# EAGLE design predkosciomierz (EAGLE 7.7.0)

## Sheet 1 of 2
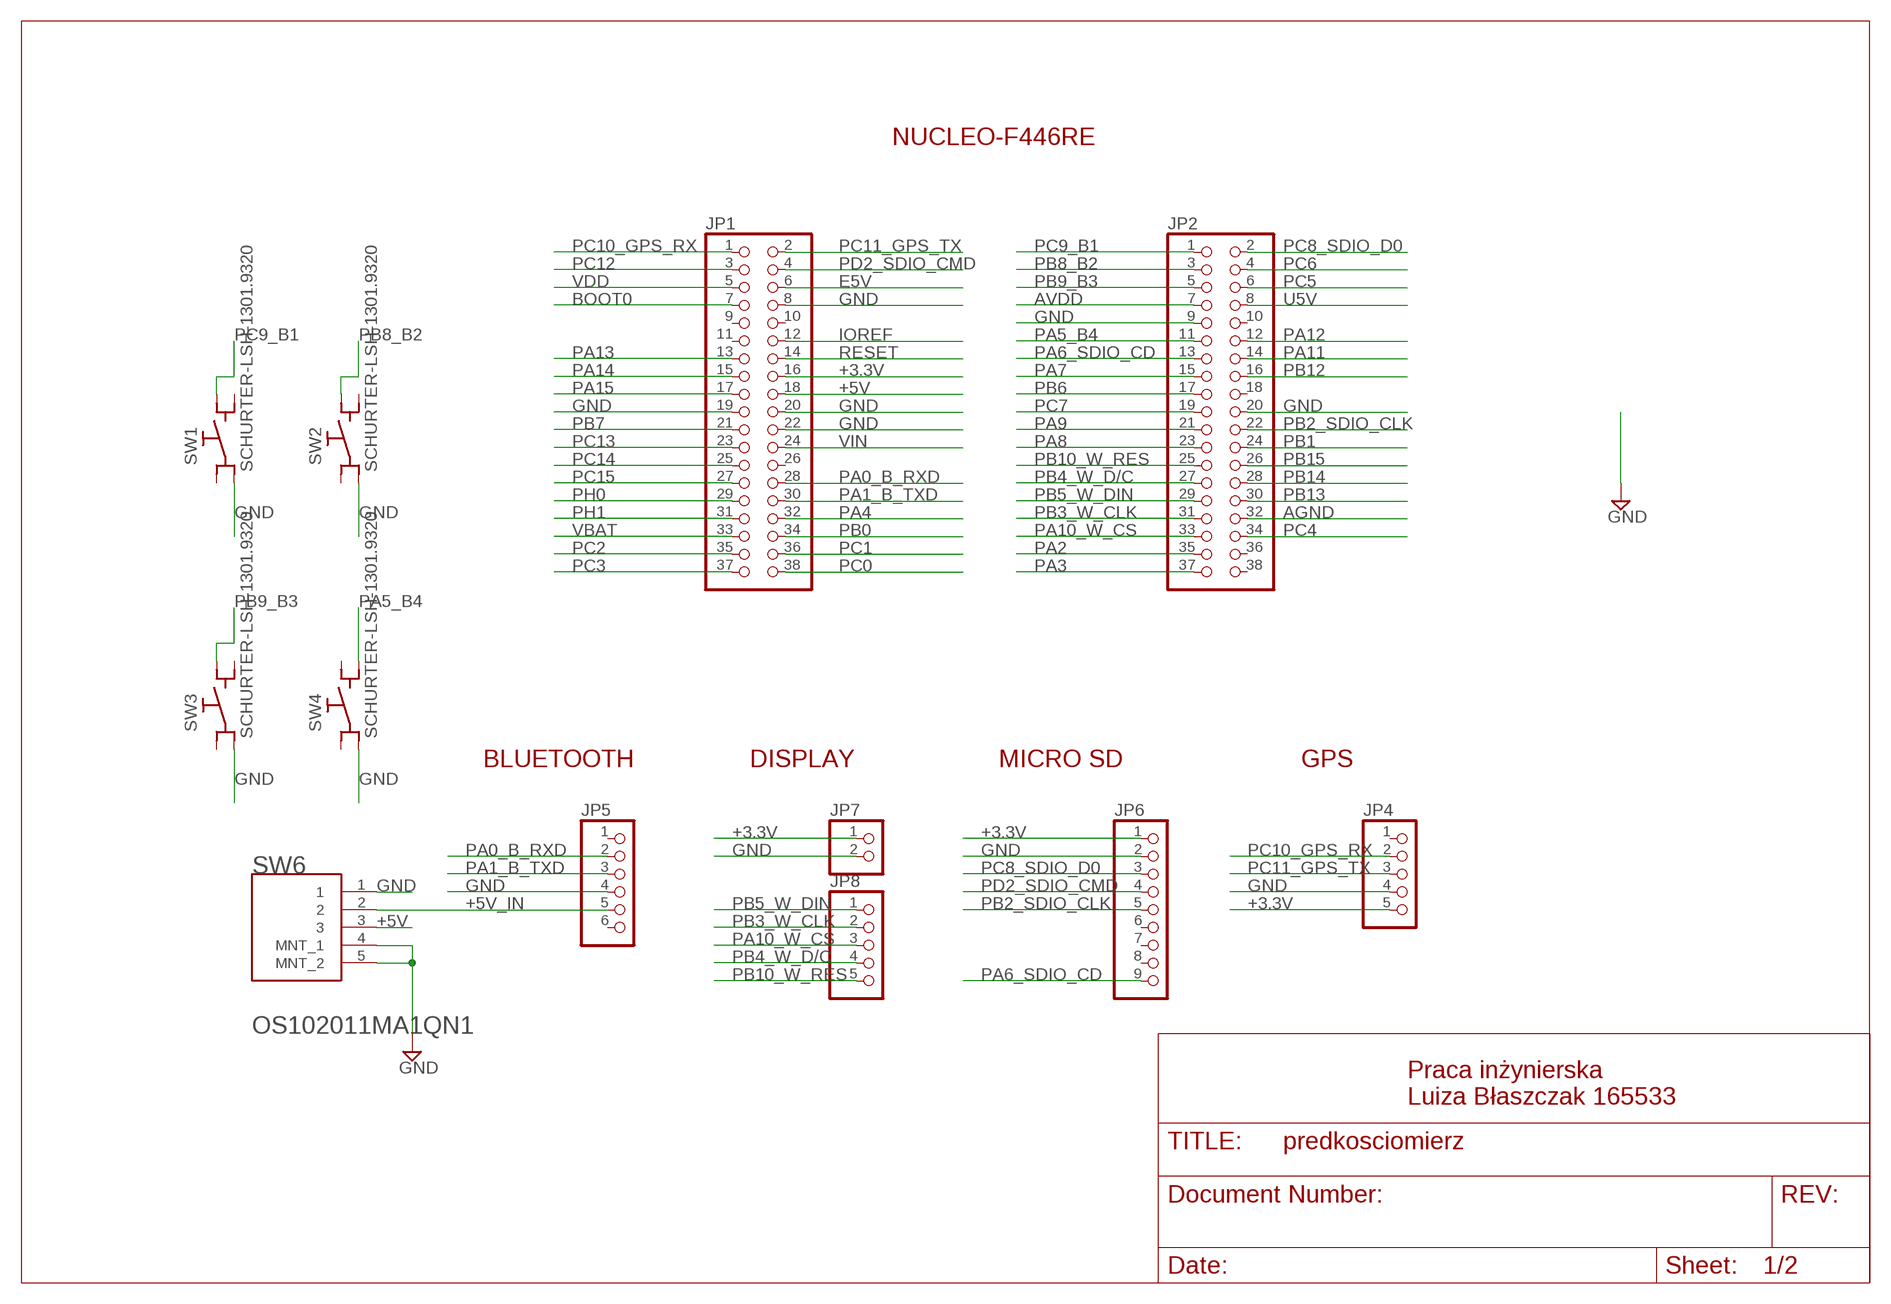
[diagram p0: schematic, sheet 1]

### Parts
JP1  PINHD-2X19  [2X19]
JP2  PINHD-2X19  [2X19]
JP4  PINHD-1X5  [1X05]
JP5  PINHD-1X6  [1X06]
JP6  PINHD-1X9  [1X09]
JP7  PINHD-1X2  [1X02]
JP8  PINHD-1X5  [1X05]
SW1  SCHURTER-LSH-1301.9320  [LSH]
SW2  SCHURTER-LSH-1301.9320  [LSH]
SW3  SCHURTER-LSH-1301.9320  [LSH]
SW4  SCHURTER-LSH-1301.9320  [LSH]
SW6  C&K_OS102011MA1QN1C&K_OS102011MA1QN1_0_0  [C&K_OS102011MA1QN1_0]

### Nets
+3.3V: JP1.16 JP4.5 JP6.1 JP7.1
+5V: JP1.18 SW6.3
+5V_IN: JP5.5 SW6.2
AGND: JP2.32
AVDD: JP2.7
BOOT0: JP1.7
E5V: JP1.6 ; also sheet 2
GND: JP1.8 JP1.19 JP1.20 JP1.22 JP2.9 JP2.20 JP4.4 JP5.4 JP6.2 JP7.2 SW1.C2(C) SW2.C2(C) SW3.C2(C) SW4.C2(C) SW6.1 SW6.4(MNT_1) SW6.5(MNT_2) ; also sheet 2
IOREF: JP1.12
PA0_B_RXD: JP1.28 JP5.2
PA1_B_TXD: JP1.30 JP5.3
PA2: JP2.35
PA3: JP2.37
PA4: JP1.32
PA5_B4: JP2.11 SW4.NO2(NO)
PA6_SDIO_CD: JP2.13 JP6.9
PA7: JP2.15
PA8: JP2.23
PA9: JP2.21
PA10_W_CS: JP2.33 JP8.3
PA11: JP2.14
PA12: JP2.12
PA13: JP1.13
PA14: JP1.15
PA15: JP1.17
PB0: JP1.34
PB1: JP2.24
PB2_SDIO_CLK: JP2.22 JP6.5
PB3_W_CLK: JP2.31 JP8.2
PB4_W_D/C: JP2.27 JP8.4
PB5_W_DIN: JP2.29 JP8.1
PB6: JP2.17
PB7: JP1.21
PB8_B2: JP2.3 SW2.NO1(NO)
PB9_B3: JP2.5 SW3.NO1(NO)
PB10_W_RES: JP2.25 JP8.5
PB12: JP2.16
PB13: JP2.30
PB14: JP2.28
PB15: JP2.26
PC0: JP1.38
PC1: JP1.36
PC2: JP1.35
PC3: JP1.37
PC4: JP2.34
PC5: JP2.6
PC6: JP2.4
PC7: JP2.19
PC8_SDIO_D0: JP2.2 JP6.3
PC9_B1: JP2.1 SW1.NO1(NO)
PC10_GPS_RX: JP1.1 JP4.2
PC11_GPS_TX: JP1.2 JP4.3
PC12: JP1.3
PC13: JP1.23
PC14: JP1.25
PC15: JP1.27
PD2_SDIO_CMD: JP1.4 JP6.4
PH0: JP1.29
PH1: JP1.31
RESET: JP1.14
U5V: JP2.8
VBAT: JP1.33
VDD: JP1.5
VIN: JP1.24
Unconnected: JP1.9 JP1.10 JP1.11 JP1.26 JP2.10 JP2.18 JP2.36 JP2.38 JP4.1 JP5.1 JP5.6 JP6.6 JP6.7 JP6.8 SW1.C1(C) SW1.NO2(NO) SW2.C1(C) SW2.NO2(NO) SW3.C1(C) SW3.NO2(NO) SW4.C1(C) SW4.NO1(NO)

### Notes on the sheet
- NUCLEO-F446RE
- BLUETOOTH | DISPLAY | MICRO SD | GPS
- Praca inżynierska 
  Luiza Błaszczak 165533

## Sheet 2 of 2
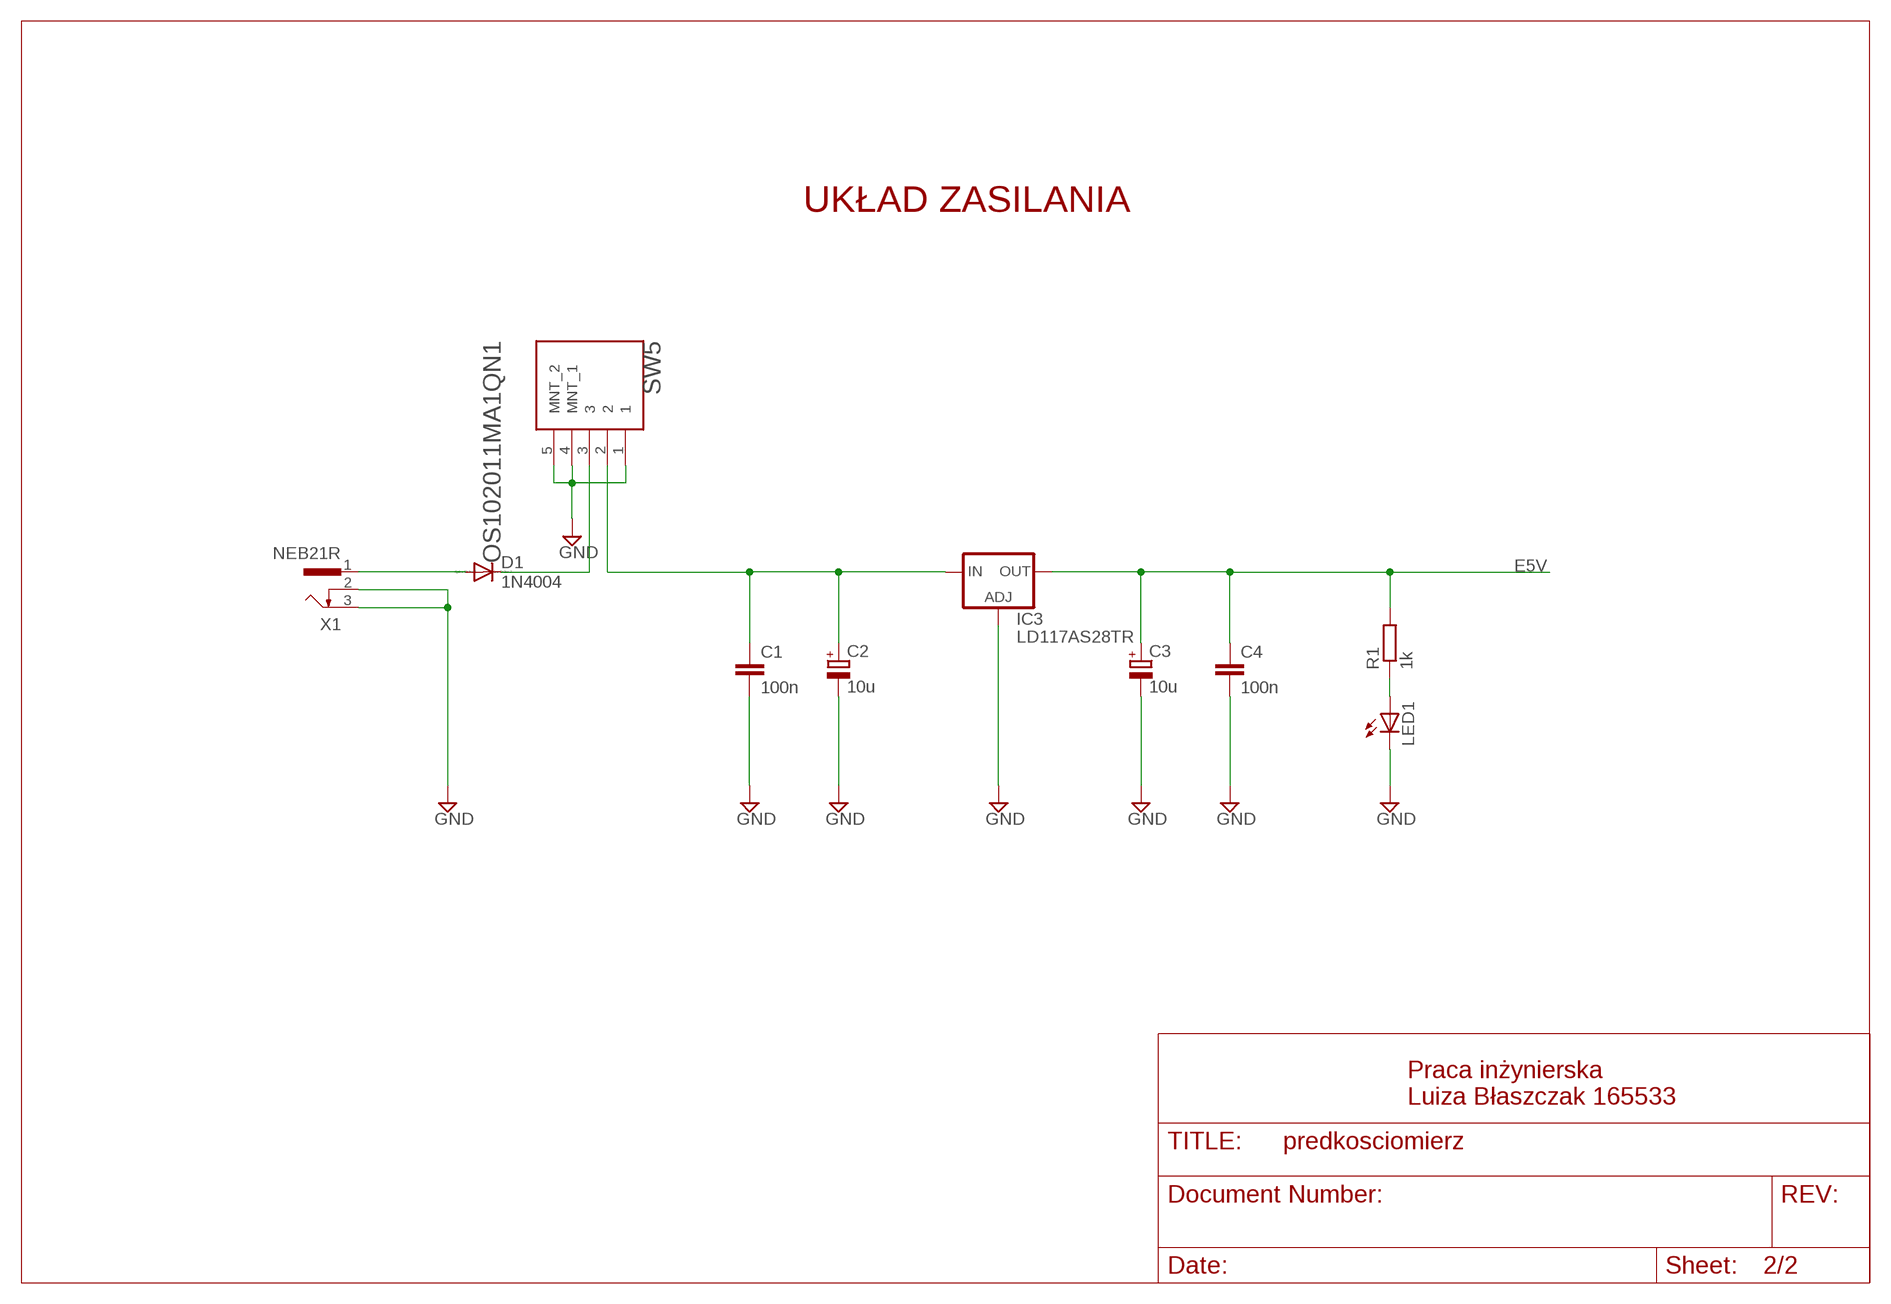
[diagram p1: schematic, sheet 2]

### Parts
C1  100n  C-EUC1210  [C1210]
C2  10u  CPOL-EUE2-5  [E2-5]
C3  10u  CPOL-EUE2-5  [E2-5]
C4  100n  C-EUC1210  [C1210]
D1  1N4004  [DO41-10]
IC3  LD117AS28TR  [SOT223]
LED1  LED5MM  [LED5MM]
R1  1k  R-EU_0204/7  [0204/7]
SW5  C&K_OS102011MA1QN1C&K_OS102011MA1QN1_0_0  [C&K_OS102011MA1QN1_0]
X1  NEB21R  [NEB21R]

### Nets
E5V: C3.+ C4.1 IC3.4(OUT) R1.2 ; also sheet 1
GND: C1.2 C2.- C3.- C4.2 IC3.1(ADJ) LED1.K(C) SW5.1 SW5.4(MNT_1) SW5.5(MNT_2) X1.2 X1.3 ; also sheet 1
N$1: LED1.A R1.1
N$2: C1.1 C2.+ IC3.3(IN) SW5.2
N$3: D1.C SW5.3
N$4: D1.A X1.1

### Notes on the sheet
- UKŁAD ZASILANIA
- Praca inżynierska
  Luiza Błaszczak 165533

## Library data of the parts
C1 C4 = rcl:C-EU: CAPACITOR, European symbol
C2 C3 = rcl:CPOL-EU: POLARIZED CAPACITOR, European symbol
D1 = diode:1N4004: DIODE general purpose rectifier, 1 A
IC3 = v-reg:LD117A?*: Low drop fixed and adjustable positive voltage regulators 1 A Source: http://www.st.com/stonline/products/literature/ds/7194/ld1117axx.pdf
JP1 JP2 = pinhead:PINHD-2X19: PIN HEADER
JP4 JP8 = pinhead:PINHD-1X5: PIN HEADER
JP5 = pinhead:PINHD-1X6: PIN HEADER
JP6 = pinhead:PINHD-1X9: PIN HEADER
JP7 = pinhead:PINHD-1X2: PIN HEADER
LED1 = led:LED: LED OSRAM: - CHIPLED LG R971, LG N971, LY N971, LG Q971, LY Q971, LO R971, LY R971 LH N974, LH R974 LS Q976, LO Q976, LY Q976 LO Q996 - Hyper CHIPLED LW Q18S LB Q993, LB Q99A, LB R99A - SideLED LS A670, LO A670, LY A670, LG A670, LP A670 LB A673, LV A673, LT A673, LW A673 LH A674 LY A675 LS A676, LA A676, LO A676, LY A676, LW A676 LS A679, LY A679, LG A679 - Hyper Micro SIDELED® LS Y876, LA Y876, LO Y876, LY Y876 LT Y87S - SmartLED LW L88C, LW L88S LB L89C, LB L89S, LG L890 LS L89K, LO L89K, LY L89K LS L896, LA L896, LO L896, LY L896 - TOPLED LS T670, LO T670, LY T670, LG T670, LP T670 LSG T670, LSP T670, LSY T670, LOP T670, LYG T670 LG T671, LOG T671, LSG T671 LB T673, LV T673, LT T673, LW T673 LH T674 LS T676, LA T676, LO T676, LY T676, LB T676, LH T676, LSB T676, LW T676 LB T67C, LV T67C, LT T67C, LS T67K, LO T67K, LY T67K, LW E67C LS E67B, LA E67B, LO E67B, LY E67B, LB E67C, LV E67C, LT E67C LW T67C LS T679, LY T679, LG T679 LS T770, LO T770, LY T770, LG T770, LP T770 LB T773, LV T773, LT T773, LW T773 LH T774 LS E675, LA E675, LY E675, LS T675 LS T776, LA T776, LO T776, LY T776, LB T776 LHGB T686 LT T68C, LB T68C - Hyper Mini TOPLED® LB M676 - Mini TOPLED Santana® LG M470 LS M47K, LO M47K, LY M47K Source: http://www.osram.convergy.de LUXEON: - LUMILED® LXK2-PW12-R00, LXK2-PW12-S00, LXK2-PW14-U00, LXK2-PW14-V00 LXK2-PM12-R00, LXK2-PM12-S00, LXK2-PM14-U00 LXK2-PE12-Q00, LXK2-PE12-R00, LXK2-PE12-S00, LXK2-PE14-T00, LXK2-PE14-U00 LXK2-PB12-K00, LXK2-PB12-L00, LXK2-PB12-M00, LXK2-PB14-N00, LXK2-PB14-P00, LXK2-PB14-Q00 LXK2-PR12-L00, LXK2-PR12-M00, LXK2-PR14-Q00, LXK2-PR14-R00 LXK2-PD12-Q00, LXK2-PD12-R00, LXK2-PD12-S00 LXK2-PH12-R00, LXK2-PH12-S00 LXK2-PL12-P00, LXK2-PL12-Q00, LXK2-PL12-R00 Source: www.luxeon.com KINGBRIGHT: KA-3528ASYC Source: www.kingbright.com
R1 = rcl:R-EU_: RESISTOR, European symbol
SW1-SW4 = schurter_switches_LSH_SMS:SCHURTER-LSH-*: Schurter LSH Printmount Switches, Gullwing Leads Momentary Action: Normally Open (NO) 6.0 x 6.0 mm Body Dim. Actuator Diam. mm / Overall Height mm / Schurter # -------------------------------------------------------------- 3.40 / 4.30 / 1301.9314.xx 3.40 / 4.30 / 1301.9315.xx 3.20 / 7.00 / 1301.9316.xx 3.30 / 7.30 / 1301.9317.xx 3.10 / 8.00 / 1301.9319.xx 3.00 / 12.5 / 1301.9320.xx xx: denotes packaging, see Schurter data sheets Author: Dipl.-Ing. FH Rainer Bayer Hochschule Heilbronn HHN: rainer.bayer@hs-heilbronn.de | http://mitarbeiter.hs-heilbronn.de/~rbayer/ Ingenieurbüro ing-rb: mail@ing-rb.de | http://www.ing-rb.de/
SW5 SW6 = C&K - OS102011MA1QN1:C&K_OS102011MA1QN1: OS Series Miniature Slide Switches; CENTROID_NOT_SPECIFIED: No; DATASHEET: https://www.ckswitches.com/media/1428/os.pdf; DIGIKEY_DESCRIPTION: SWITCH SLIDE SPDT 100MA 12V; DIGIKEY_PART_NUMBER: CKN9559-ND; LEAD_FREE: yes; MF: C&K; MOUSER_PART_NUMBER: OS102011MA1QN1; MPN: OS102011MA1QN1; PACKAGE: SW_SLIDE; PREFIX: SW; ROHS: yes; TEMPERATURE_RANGE_HIGH: +70°C; TEMPERATURE_RANGE_LOW: -30°C
X1 = con-lumberg:NEB21R: Netzgeräte-Einbaukupplung abgewinkelte Ausführung mit Öffner Source: http://www.lumberg.com/Produkte/PDFs/NEB21R.pdf; MPN: NEB 21 R; OC_FARNELL: 1217037; OC_NEWARK: 97K6458

## Board
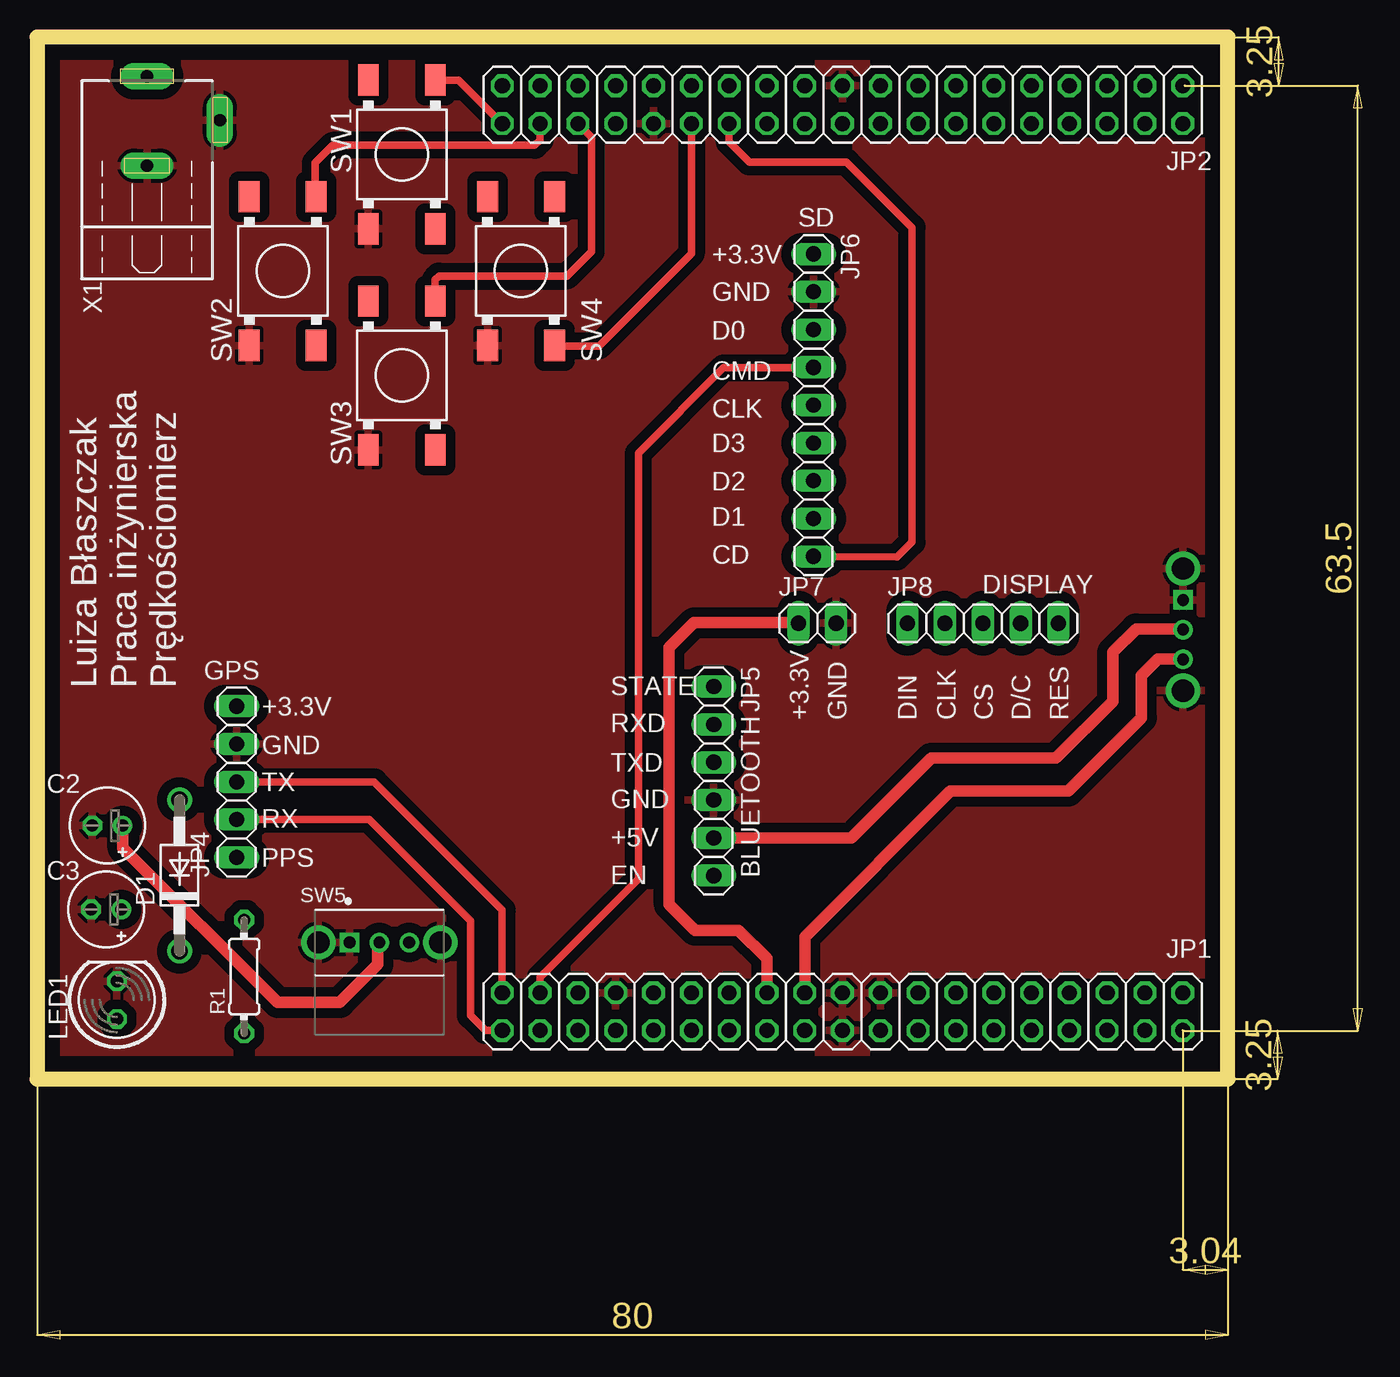
[diagram p2: board, top side]
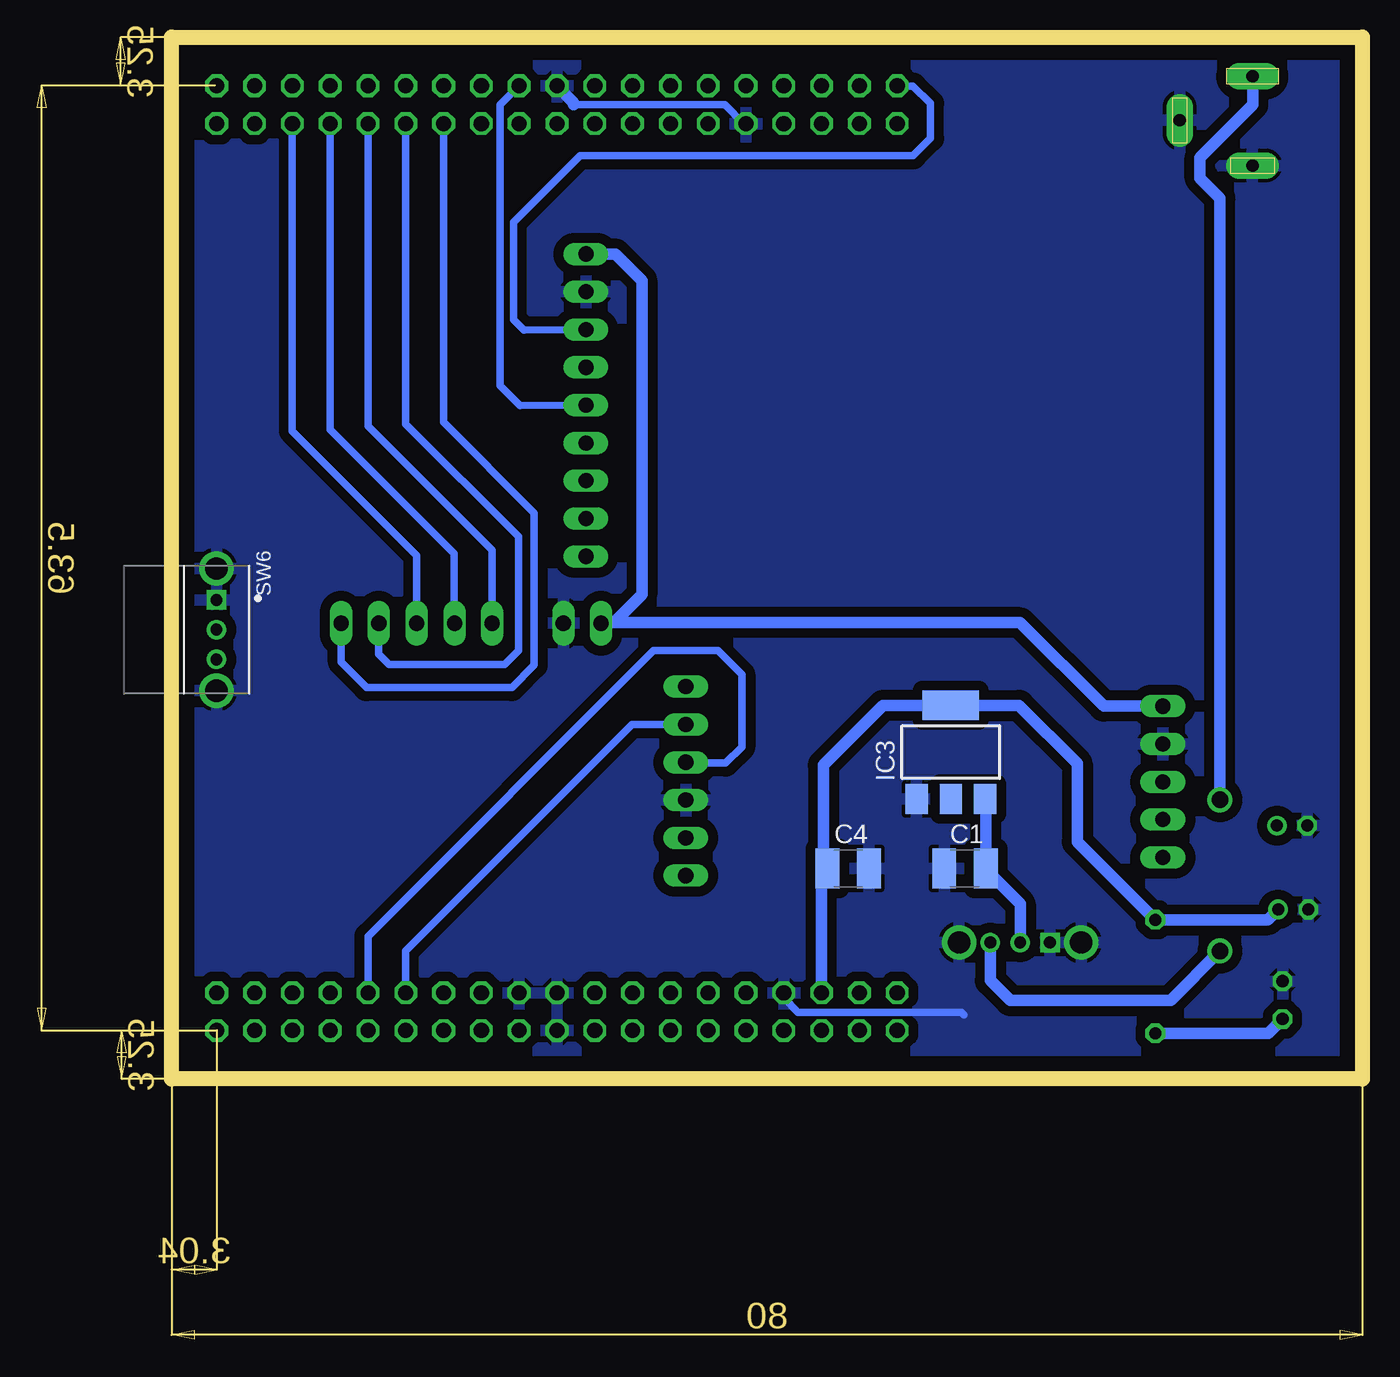
[diagram p3: board, bottom side, seen from below]

Size 80 x 70 mm. Coordinates in mm from the lower left corner, seen from the top.
Outline: 0,0 80,0 80,70 0,70 0,0
Copper layers (1*16): Top 0.035mm / dielectric 1.5mm / Bottom 0.035mm
Design rules "default": minimum track width 10mil, minimum drill 24mil, track to track 8mil, track to pad 8mil, pad to pad 8mil, via to via 8mil, smd to smd 8mil, copper to edge 40mil, drill to drill 8mil, minimum pad ring 10mil, minimum via ring 8mil, stop-mask expansion 4mil, vias tented up to drill 0mil, thermal gap 10mil

### Footprints (pad centres in the part's own frame; a part is rotated, then mirrored left to right if it is on the bottom)
C1210 = smd 1.6 x 2.7: 1 -1.4,0; 2 1.4,0
E2-5 = drill 0.813 pad 1.27: + -1.016,0 | drill 0.813 pad 1.27 octagon: - 1.016,0
DO41-10 = drill 1.118: A 5.08,0; C -5.08,0
SOT223 = smd 1.5 x 2: 1 -2.3,-3.15; 2 0,-3.15; 3 2.3,-3.15 | smd 3.8 x 2: 4 0,3.15
2X19 = drill 1.016 octagon: 1 -22.86,-1.27; 2 -22.86,1.27; 3 -20.32,-1.27; 4 -20.32,1.27; 5 -17.78,-1.27; 6 -17.78,1.27; 7 -15.24,-1.27; 8 -15.24,1.27; 9 -12.7,-1.27; 10 -12.7,1.27; 11 -10.16,-1.27; 12 -10.16,1.27; 13 -7.62,-1.27; 14 -7.62,1.27; 15 -5.08,-1.27; 16 -5.08,1.27; 17 -2.54,-1.27; 18 -2.54,1.27; 19 0,-1.27; 20 0,1.27; 21 2.54,-1.27; 22 2.54,1.27; 23 5.08,-1.27; 24 5.08,1.27; 25 7.62,-1.27; 26 7.62,1.27; 27 10.16,-1.27; 28 10.16,1.27; 29 12.7,-1.27; 30 12.7,1.27; 31 15.24,-1.27; 32 15.24,1.27; 33 17.78,-1.27; 34 17.78,1.27; 35 20.32,-1.27; 36 20.32,1.27; 37 22.86,-1.27; 38 22.86,1.27
1X05 = drill 1.016 long: 1 -5.08,0; 2 -2.54,0; 3 0,0; 4 2.54,0; 5 5.08,0
1X06 = drill 1.016 long: 1 -6.35,0; 2 -3.81,0; 3 -1.27,0; 4 1.27,0; 5 3.81,0; 6 6.35,0
1X09 = drill 1.016 long: 1 -10.16,0; 2 -7.62,0; 3 -5.08,0; 4 -2.54,0; 5 0,0; 6 2.54,0; 7 5.08,0; 8 7.62,0; 9 10.16,0
1X02 = drill 1.016 long: 1 -1.27,0; 2 1.27,0
LED5MM = drill 0.813 octagon: A -1.27,0; K 1.27,0
0204/7 = drill 0.813 octagon: 1 -3.81,0; 2 3.81,0
LSH = smd 2.1 x 1.4: C1 -5,-2.25; C2 5,-2.25; NO1 -5,2.25; NO2 5,2.25
C&K_OS102011MA1QN1_0 = drill 0.8 pad 1.3 square: 1 -2,2 | drill 0.8 pad 1.3: 2 0,2; 3 2,2 | drill 1.5 pad 2.3: 4 -4.1,2; 5 4.1,2
NEB21R = drill 0.813 pad 1.778 long: 1 0,7.35; 2 4.9,4.4; 3 0,1.35

### Placement (x,y rotation side)
C1  26.69,14.14 180 bottom
C2  4.72,17.03 180 top
C3  4.64,11.39 180 top
C4  34.54,14.14 0 bottom
D1  9.56,13.68 90 top
IC3  27.64,21.96 0 bottom
JP1  54.11,4.53 0 top
JP2  54.11,65.47 0 top
JP4  13.4,19.97 90 top
JP5  45.45,20.01 270 top
JP6  52.17,45.28 270 top
JP7  52.42,30.62 0 top
JP8  63.54,30.62 0 top
LED1  5.36,5.3 90 top
R1  13.9,6.89 90 top
SW1  24.5,62.13 270 top
SW2  16.5,54.29 270 top
SW3  24.5,47.27 270 top
SW4  32.5,54.29 270 top
SW5  22.99,7.17 0 top
SW6  78.99,30.19 270 bottom
X1  7.37,60.02 0 top

### Tracks (layer width: path | path; a pad name or v marks a point on that pad's centre or on a via)
+3.3V
  Top 0.762: JP1.16 49.03,8.09 47.13,9.99 44.19,9.99 42.45,11.73 42.45,28.99 44.13,30.67 51.09,30.67 JP7.1
  Bottom 0.762: JP4.5 17.38,25.05 23,30.67 50.28,30.67 | 50.28,30.67 51.09,30.67 JP7.1 | JP6.1 50.18,55.44 48.4,53.66 48.4,32.55 50.28,30.67
+5V
  Top 0.762: JP1.18 51.57,9.56 61.36,19.35 69.27,19.35 74.19,24.27 74.19,27.12 75.3,28.22 76.97,28.22 SW6.3
+5V_IN
  Top 0.762: JP5.5 54.7,16.2 60.07,21.57 68.46,21.57 72.27,25.38 72.27,28.67 73.84,30.24 76.95,30.24 SW6.2
E5V
  Bottom 0.762: JP1.6 36.33,13.75 C4.1 36.21,14.41 36.21,21.09 32.19,25.11 IC3.4 23.07,25.11 19.15,21.19 19.15,15.94 R1.2 6.35,10.7 C3.+
GND
  Bottom 0.508: JP2.20 54.21,66.64 | JP2.9 41.58,64.18 42.82,65.46 52.98,65.46 | JP1.8 38.87,5.45 37.91,4.49 26.92,4.49 26.75,4.32
  Bottom 0.762: 52.98,65.46 52.98,65.61 JP2.20
  pour Bottom (isolate 0.66): 0.06,69.77 0.06,0.1 80.11,0.28 80.04,70.77 0.17,70.77
  pour Top (isolate 0.66): 0.23,70 80.18,70.22 80.18,0.14 0.23,-0.08
N$1
  Bottom 0.762: R1.1 6.31,3.08 LED1.A
N$2
  Top 0.762: C2.+ 5.76,17 5.76,15.54 16.16,5.14 20.33,5.14 22.89,7.7 22.89,9.07 SW5.2
  Bottom 0.762: C1.1 25.29,18.76 IC3.3 | 25.22,14.21 C1.1 | C1.1 25.29,14.07 22.98,11.76 22.98,9.19 SW5.2
N$3
  Bottom 0.762: SW5.3 24.99,6.62 23.66,5.28 12.88,5.28 D1.C
N$4
  Bottom 0.762: D1.A 9.56,59.18 10.91,60.53 10.91,61.91 7.35,65.47 7.35,67.35 X1.1
PA0_B_RXD
  Bottom 0.508: JP1.28 64.27,8.62 49.06,23.83 JP5.2
PA1_B_TXD
  Bottom 0.508: JP1.30 66.81,9.58 47.61,28.78 43.29,28.78 41.7,27.19 41.7,22.3 42.77,21.22 44.31,21.22 JP5.3
PA5_B4
  Top 0.508: JP2.11 43.95,55.46 37.75,49.26 34.79,49.26 SW4.NO2
PA6_SDIO_CD
  Top 0.508: JP6.9 57.78,35.08 58.78,36.08 58.78,57.22 54.39,61.61 47.85,61.61 46.5,62.97 JP2.13
PA10_W_CS
  Bottom 0.508: JP2.33 71.89,43.54 63.53,35.17 63.53,30.64 JP8.3
PB2_SDIO_CLK
  Bottom 0.508: JP6.5 56.59,45.24 57.93,46.58 57.93,65.45 JP2.22
PB3_W_CLK
  Bottom 0.508: JP2.31 69.35,43.65 61.01,35.3 JP8.2
PB4_W_D/C
  Bottom 0.508: JP2.27 64.27,44.02 56.7,36.45 56.7,28.79 57.63,27.87 65.39,27.87 66.1,28.57 66.1,30.6 JP8.4
PB5_W_DIN
  Bottom 0.508: JP2.29 66.81,43.88 58.46,35.53 JP8.1
PB8_B2
  Top 0.508: JP2.3 33.79,63.09 33.43,62.73 19.86,62.73 18.69,61.56 18.69,59.35 SW2.NO1
PB9_B3
  Top 0.508: SW3.NO1 26.75,53.7 27,53.95 35.59,53.95 37.23,55.59 37.23,63.3 JP2.5
PB10_W_RES
  Bottom 0.508: JP2.25 61.73,44.14 55.63,38.04 55.63,27.8 57.13,26.3 66.91,26.3 68.61,28.01 JP8.5
PC8_SDIO_D0
  Bottom 0.508: JP6.3 56.32,50.32 57.01,51.01 57.01,57.56 52.55,62.03 30.18,62.03 29.01,63.2 29.01,65.55 30.18,66.72 31.24,66.72 JP2.2
PC9_B1
  Top 0.508: SW1.NO1 28.32,67.13 JP2.1
PC10_GPS_RX
  Top 0.508: JP1.1 30.12,3.26 29.11,4.26 29.11,10.62 22.3,17.44 13.81,17.44 JP4.2
PC11_GPS_TX
  Top 0.508: JP1.2 31.25,11.36 22.65,19.96 13.81,19.96 JP4.3
PD2_SDIO_CMD
  Top 0.508: JP1.4 33.79,6.84 40.39,13.43 40.39,42.05 46.13,47.79 52.13,47.79 JP6.4

### Text on the board
tNames: SD | +3.3V | GND | D0 | CMD | CLK | D3 | D2 | D1 | CD | DISPLAY | GPS | Luiza Błaszczak / Praca inżynierska / Prędkościomierz | STATE | +3.3V | +3.3V | GND | DIN | CLK | CS | D/C | RES | RXD | GND | TXD | TX | GND | RX | +5V | PPS | BLUETOOTH | EN